# Altium schematic sheet Sheet1.SchDoc
size A; SheetNumber: 1; SheetTotal: 1
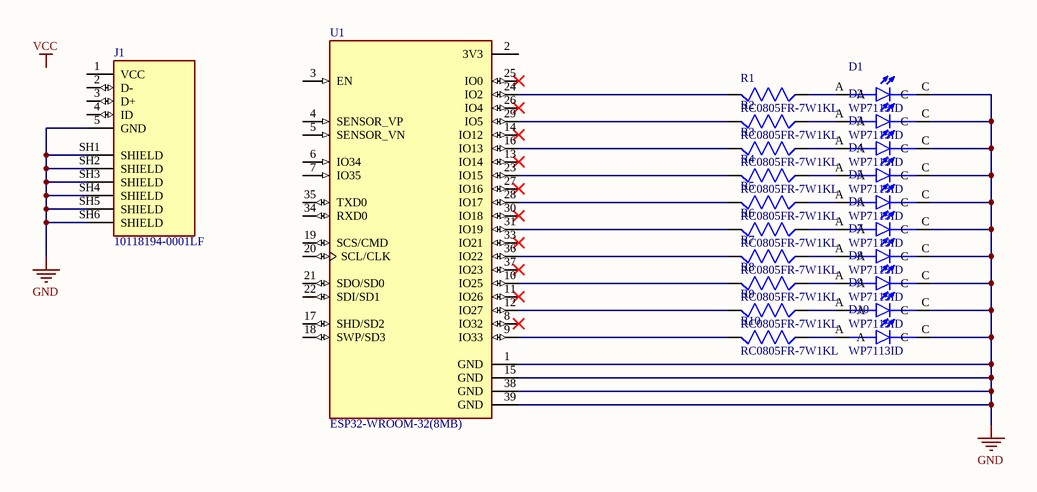
[diagram p0: Sheet1.SchDoc]

## Parts
D1  WP7113ID  [LED_WP7113ID]
D2  WP7113ID  [LED_WP7113ID]
D3  WP7113ID  [LED_WP7113ID]
D4  WP7113ID  [LED_WP7113ID]
D5  WP7113ID  [LED_WP7113ID]
D6  WP7113ID  [LED_WP7113ID]
D7  WP7113ID  [LED_WP7113ID]
D8  WP7113ID  [LED_WP7113ID]
D9  WP7113ID  [LED_WP7113ID]
D10  WP7113ID  [LED_WP7113ID]
J1  10118194-0001LF  [AMPHENOL_10118194-0001LF]
R1  RC0805FR-7W1KL  [RESC2012X60N]
R2  RC0805FR-7W1KL  [RESC2012X60N]
R3  RC0805FR-7W1KL  [RESC2012X60N]
R4  RC0805FR-7W1KL  [RESC2012X60N]
R5  RC0805FR-7W1KL  [RESC2012X60N]
R6  RC0805FR-7W1KL  [RESC2012X60N]
R7  RC0805FR-7W1KL  [RESC2012X60N]
R8  RC0805FR-7W1KL  [RESC2012X60N]
R9  RC0805FR-7W1KL  [RESC2012X60N]
R10  RC0805FR-7W1KL  [RESC2012X60N]
U1  ESP32-WROOM-32(8MB)  [MODULE_ESP32-WROOM-32(8MB)]

## Nets
GND: D1.C D2.C D3.C D4.C D5.C D6.C D7.C D8.C D9.C D10.C J1.5(GND) J1.SH1(SHIELD) J1.SH2(SHIELD) J1.SH3(SHIELD) J1.SH4(SHIELD) J1.SH5(SHIELD) J1.SH6(SHIELD) U1.1(GND) U1.15(GND) U1.38(GND) U1.39(GND)
NetD1_A: D1.A R1.2
NetD2_A: D2.A R2.2
NetD3_A: D3.A R3.2
NetD4_A: D4.A R4.2
NetD5_A: D5.A R5.2
NetD6_A: D6.A R6.2
NetD7_A: D7.A R7.2
NetD8_A: D8.A R8.2
NetD9_A: D9.A R9.2
NetD10_A: D10.A R10.2
NetR1_1: R1.1 U1.24(IO2)
NetR2_1: R2.1 U1.29(IO5)
NetR3_1: R3.1 U1.16(IO13)
NetR4_1: R4.1 U1.23(IO15)
NetR5_1: R5.1 U1.28(IO17)
NetR6_1: R6.1 U1.31(IO19)
NetR7_1: R7.1 U1.36(IO22)
NetR8_1: R8.1 U1.10(IO25)
NetR9_1: R9.1 U1.12(IO27)
NetR10_1: R10.1 U1.9(IO33)

Not connected (* = marked no-connect by the designer): J1 1(VCC) 2(D-) 3(D+) 4(ID); U1 2(3V3) 3(EN) 4(SENSOR_VP) 5(SENSOR_VN) 6(IO34) 7(IO35) 8(IO32)* 11(IO26)* 13(IO14)* 14(IO12)* 17(SHD/SD2) 18(SWP/SD3) 19(SCS/CMD) 20(SCL/CLK) 21(SDO/SD0) 22(SDI/SD1) 25(IO0)* 26(IO4)* 27(IO16)* 30(IO18)* 33(IO21)* 34(RXD0) 35(TXD0) 37(IO23)*

## Notes on the sheet
- Labels drawn without touching a wire or pin: VCC

## Library data of the parts
D1-D10 = WP7113ID: Red 617nm LED Indication - Discrete 2V Radial; MF: Kingbright; Price: None; MP: WP7113ID; Package: Radial Kingbright; Check_prices: https://www.snapeda.com/parts/WP7113ID/Kingbright/view-part/?ref=eda; Purchase-URL: https://pricing.snapeda.com/search/part/WP7113ID/?ref=eda; Availability: In Stock; Value: *; SnapEDA_Link: https://www.snapeda.com/parts/WP7113ID/Kingbright/view-part/?ref=snap
J1 = 10118194-0001LF: Micro USB, Input Output Connectors, B TYPE RECEPTACLE with flange; MF: Amphenol ICC; SnapEDA_Link: https://www.snapeda.com/parts/10118194-0001LF/Amphenol+FCI/view-part/?ref=snap; Package: None; Value: *; MP: 10118194-0001LF; Check_prices: https://www.snapeda.com/parts/10118194-0001LF/Amphenol+FCI/view-part/?ref=eda
U1 = ESP32-WROOM-32(8MB): Bluetooth, WiFi 802.11b/g/n, Bluetooth v4.2 +EDR, Class 1, 2 and 3 Transceiver Module 2.4GHz ~ 2.5GHz Antenna Not Included, U.FL Surface Mount; MF: Espressif Systems; Value: *; SnapEDA_Link: https://www.snapeda.com/parts/ESP32-WROOM-32%20(8MB)/Espressif+Systems/view-part/?ref=snap; Availability: Not in stock; Price: None; Package: Module Espressif Systems; Check_prices: https://www.snapeda.com/parts/ESP32-WROOM-32%20(8MB)/Espressif+Systems/view-part/?ref=eda; MP: ESP32-WROOM-32 (8MB)
R1-R10 = RC0805FR-7W1KL: Price: None; Value: *; Package: None; MP: RC0805FR-7W1KL; Availability: Unavailable